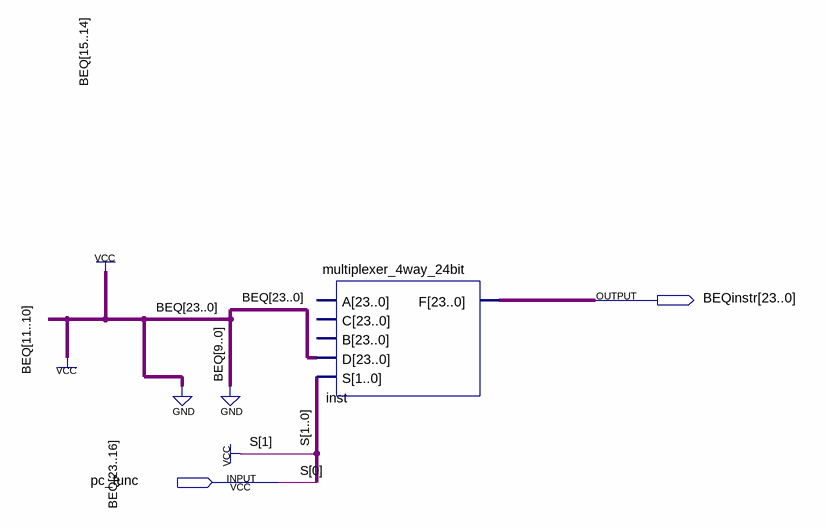
[diagram p0: schematic sheet]
// Quartus schematic beq.bdf as structural Verilog: 1 symbols, 2 pins
module beq (
  input  pc_func,
  output [23:0] BEQinstr
);

  wire [13:12] BEQ;

  multiplexer_4way_24bit inst (
    .D({10'b0000000011, BEQ, 12'b110000000000}), .S({1'b1, pc_func}), .F(BEQinstr));  // open: A, C, B

  // Other names for the same wires on the sheet: S[0] = pc_func
endmodule
